# EAGLE design expansion-sn76489-kempton-sd-rev4b (EAGLE 9.6.2)
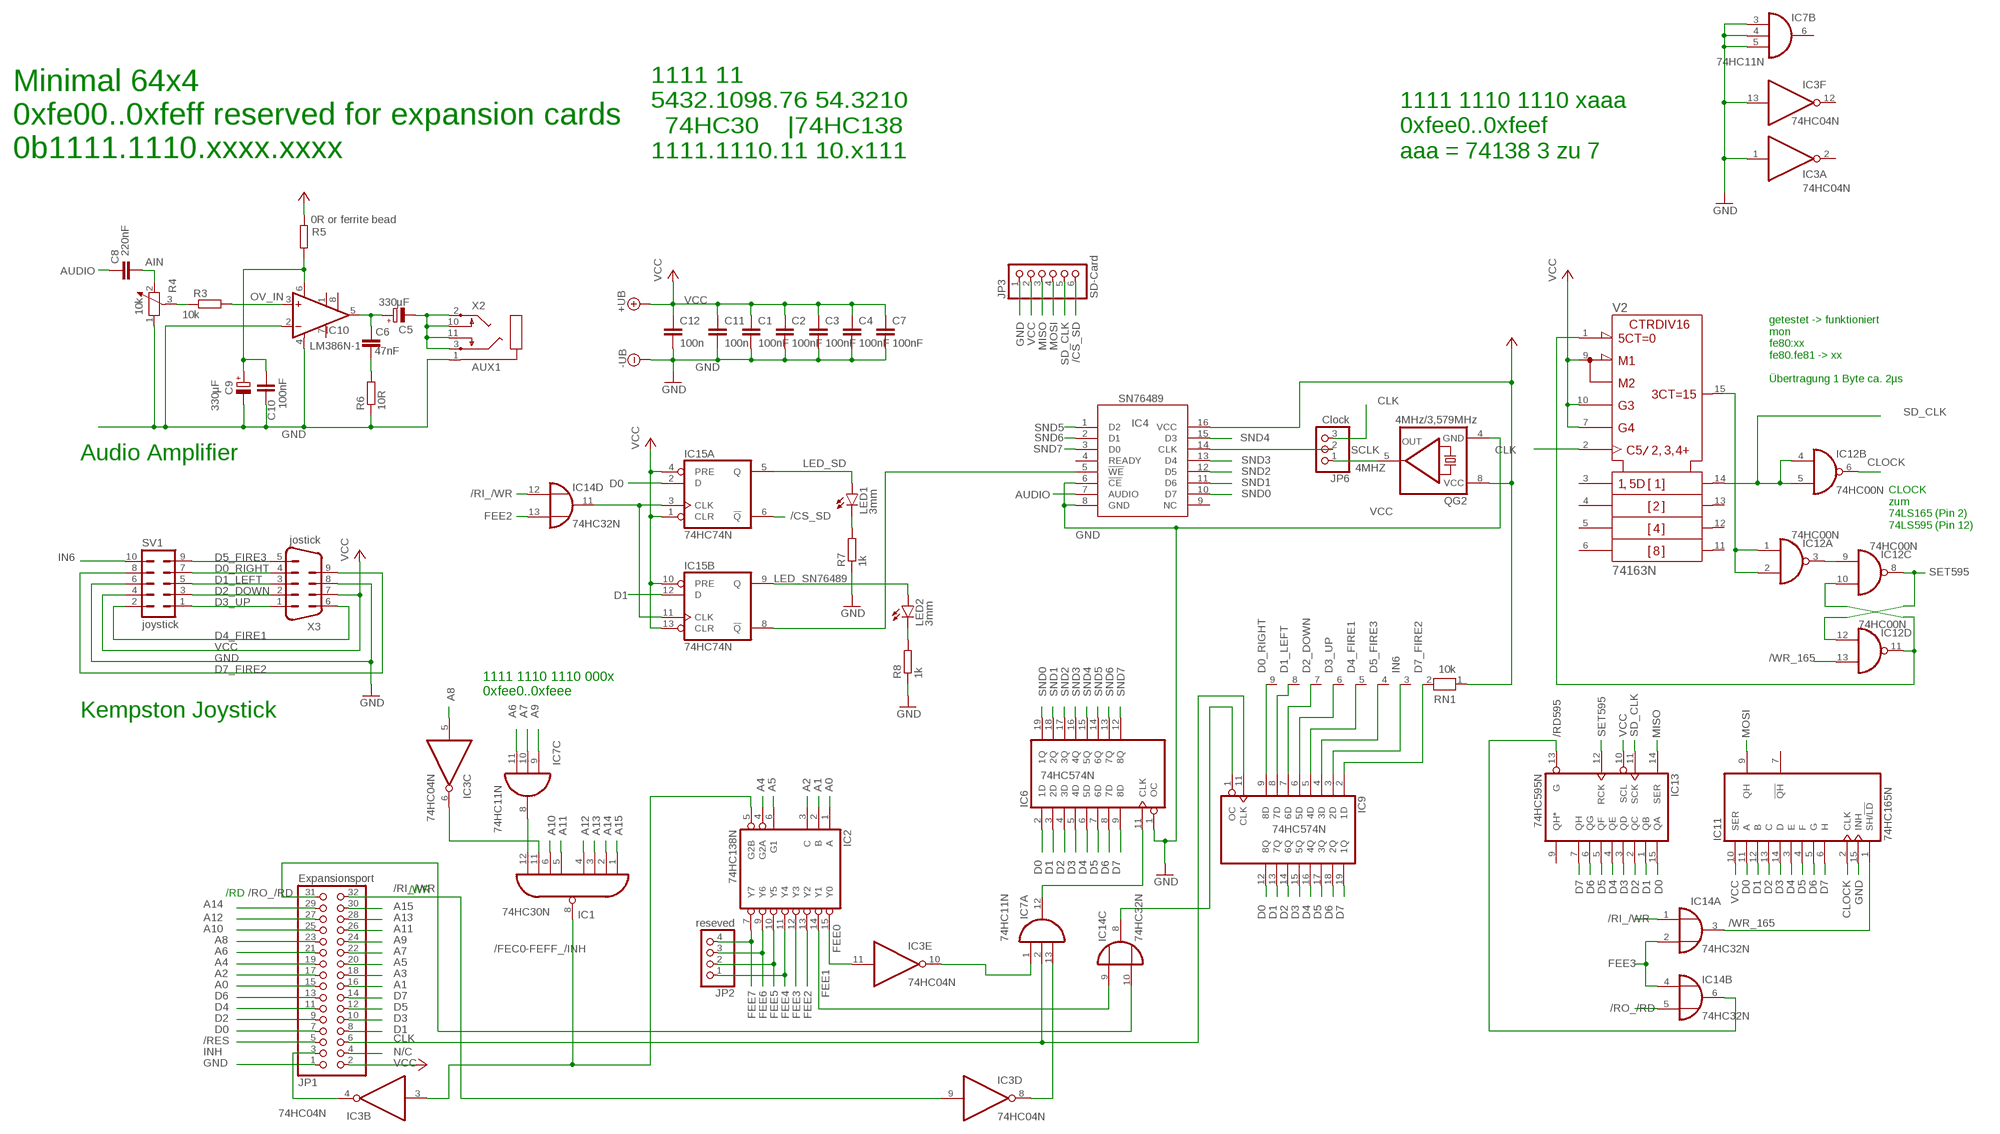
[diagram p0: schematic, sheet 1]

## Parts
C1  100nF  C-EU050-025X075  [C050-025X075]
C2  100nF  C-EU050-025X075  [C050-025X075]
C3  100nF  C-EU050-025X075  [C050-025X075]
C4  100nF  C-EU050-025X075  [C050-025X075]
C5  330µF  CPOL-EUE2.5-7  [E2,5-7]
C6  47nF  C-EU050-025X075  [C050-025X075]
C7  100nF  C-EU050-025X075  [C050-025X075]
C8  220nF  C-EU050-025X075  [C050-025X075]
C9  330µF  CPOL-EUE2.5-7  [E2,5-7]
C10  100nF  C-EU050-025X075  [C050-025X075]
C11  100n  C-EU050-025X075  [C050-025X075]
C12  100n  C-EU050-025X075  [C050-025X075]
IC1  74HC30N  [DIL14]
IC2  74HC138N  [DIL16]
IC3  74HC04N  [DIL14]
IC4  SN76489  ALEX-PARTS_SN76489AN  [ALEX-PARTS_DIL16]
IC6  74HC574N  [DIL20]
IC7  74HC11N  [DIL14]
IC9  74HC574N  [DIL20]
IC10  LM386N-1  [DIL08]
IC11  74HC165N  [DIL16]
IC12  74HC00N  [DIL14]
IC13  74HC595N  [DIL16]
IC14  74HC32N  [DIL14]
IC15  74HC74N  [DIL14]
JP1  Expansionsport  PINHD-2X16  [2X16]
JP2  reseved  PINHD-1X4  [1X04]
JP3  SD-Card  PINHD-1X6  [1X06]
JP6  Clock  PINHD-1X3  [1X03]
LED1  3mm  LED3MM  [LED3MM]
LED2  3mm  LED3MM  [LED3MM]
QG2  4MHz/3,579MHz  QG5460  [DIL08S]
R3  10k  R-EU_0207/10  [0207/10]
R4  10k  POTENTIOMETER_PT-10S  [PT-10S]
R5  0R or ferrite bead  R-EU_0207/10  [0207/10]
R6  10R  R-EU_0207/10  [0207/10]
R7  1k  R-EU_0207/10  [0207/10]
R8  1k  R-EU_0207/10  [0207/10]
RN1  10k  RN08  [RN-9]
SV1  joystick  ML10  [ML10]
V2  74163N  [DIL16]
X2  AUX1  CON-SJ1-352XNSJ1-352XN  [SJ1-352XN]
X3  jostick  M09-182  [182-009-MALE]

## Nets
4MHZ: JP6.1 QG2.5(OUT)
/CS_SD: IC15.6(A:!Q) JP3.6
/FEC0-FEFF_/INH: IC1.8(O) IC2.5(G2B) IC3.3(B:I)
/RD595: IC13.13(G) IC14.6(B:O)
/RES: JP1.5
/RI_/WR: IC3.9(D:I) IC14.1(A:I0) IC14.12(D:I0) JP1.32
/RO_/RD: IC14.5(B:I1) IC14.10(C:I1) JP1.31
/WR_165: IC11.1(SH/!LD) IC12.13(D:I1) IC14.3(A:O)
A0: IC2.1(A) JP1.15
A1: IC2.2(B) JP1.16
A2: IC2.3(C) JP1.17
A3: JP1.18
A4: IC2.4(G2A) JP1.19
A5: IC2.6(G1) JP1.20
A6: IC7.11(C:I2) JP1.21
A7: IC7.10(C:I1) JP1.22
A8: IC3.5(C:I) JP1.23
A9: IC7.9(C:I0) JP1.24
A10: IC1.6(I5) JP1.25
A11: IC1.5(I4) JP1.26
A12: IC1.4(I3) JP1.27
A13: IC1.3(I2) JP1.28
A14: IC1.2(I1) JP1.29
A15: IC1.1(I0) JP1.30
AIN: C8.2 R4.2
AUDIO: C8.1 IC4.7(AUDIO)
AUXOUT1: C5.- X2.2 X2.3 X2.10 X2.11
AVCC [power]: C9.+ C10.1 IC10.6(VS) R5.1
CLK: IC7.2(A:I1) IC9.11(CLK) JP1.6 JP6.3 V2.2(CLK)
CLOCK: IC11.2(CLK) IC12.6(B:O)
D0: IC6.2(1D) IC9.12(8Q) IC11.11(A) IC13.15(QA) IC15.2(A:D) JP1.7
D0_RIGHT: IC9.9(8D) RN1.9 SV1.7 X3.4
D1: IC6.3(2D) IC9.13(7Q) IC11.12(B) IC13.1(QB) IC15.12(B:D) JP1.8
D1_LEFT: IC9.8(7D) RN1.8 SV1.5 X3.3
D2: IC6.4(3D) IC9.14(6Q) IC11.13(C) IC13.2(QC) JP1.9
D2_DOWN: IC9.7(6D) RN1.7 SV1.3 X3.2
D3: IC6.5(4D) IC9.15(5Q) IC11.14(D) IC13.3(QD) JP1.10
D3_UP: IC9.6(5D) RN1.6 SV1.1 X3.1
D4: IC6.6(5D) IC9.16(4Q) IC11.3(E) IC13.4(QE) JP1.11
D4_FIRE1: IC9.5(4D) RN1.5 SV1.2 X3.6
D5: IC6.7(6D) IC9.17(3Q) IC11.4(F) IC13.5(QF) JP1.12
D5_FIRE3: IC9.4(3D) RN1.4 SV1.9 X3.5
D6: IC6.8(7D) IC9.18(2Q) IC11.5(G) IC13.6(QG) JP1.13
D7: IC6.9(8D) IC9.19(1Q) IC11.6(H) IC13.7(QH) JP1.14
D7_FIRE2: IC9.2(1D) RN1.2 SV1.8 X3.9
FEE0: IC2.15(Y0) IC3.11(E:I)
FEE1: IC2.14(Y1) IC14.9(C:I0)
FEE2: IC2.13(Y2) IC14.13(D:I1)
FEE3: IC2.12(Y3) IC14.2(A:I1) IC14.4(B:I0)
FEE4: IC2.11(Y4) JP2.1
FEE5: IC2.10(Y5) JP2.2
FEE6: IC2.9(Y6) JP2.3
FEE7: IC2.7(Y7) JP2.4
GND [power]: C1.2 C2.2 C3.2 C4.2 C7.2 C9.- C10.2 C11.2 C12.2 IC3.1(A:I) IC3.13(F:I) IC4.6(!CE) IC4.8(GND) IC6.1(OC) IC7.3(B:I0) IC7.4(B:I1) IC7.5(B:I2) IC10.2(-IN) IC10.4(GND) IC11.15(INH) JP1.1 JP3.1 QG2.4(GND) R4.1 R6.1 R7.1 R8.1 SV1.6 X2.1 X3.8 ; supply symbol labelled -UB
IN6: IC9.3(2D) RN1.3 SV1.10
INH: IC3.4(B:O) JP1.3
INPUT_EN: IC9.1(OC) IC14.8(C:O)
LED_SD: IC15.5(A:Q) LED1.A
LED_SN76489: IC15.9(B:Q) LED2.A
MISO: IC13.14(SER) JP3.3
MOSI: IC11.9(QH) JP3.4
N$1: LED2.K(C) R8.2
N$2: IC3.10(E:O) IC7.1(A:I0)
N$3: IC1.12(I7) IC7.8(C:O)
N$6: C6.2 R6.2
N$7: IC12.1(A:I0) IC12.2(A:I1) V2.15(RCO)
N$8: R3.1 R4.3
N$9: IC12.10(C:I1) IC12.11(D:O) V2.1(!CLR)
N$10: IC12.3(A:O) IC12.9(C:I0)
N$11: IC14.11(D:O) IC15.3(A:CLK) IC15.11(B:CLK)
N$12: LED1.K(C) R7.2
N$14: IC4.5(!WE) IC15.8(B:!Q)
N$19: IC1.11(I6) IC3.6(C:O)
N/C: JP1.4
OV_IN: IC10.3(+IN) R3.2
R2C2C3: C5.+ C6.1 IC10.5(OUT)
RI_WR: IC3.8(D:O) IC7.13(A:I2)
SCLK: IC4.14(CLK) JP6.2
SD_CLK: IC12.4(B:I0) IC12.5(B:I1) IC13.11(SCK) JP3.5 V2.14(QA)
SET595: IC12.8(C:O) IC12.12(D:I0) IC13.12(RCK)
SND0: IC4.10(D7) IC6.19(1Q)
SND1: IC4.11(D6) IC6.18(2Q)
SND2: IC4.12(D5) IC6.17(3Q)
SND3: IC4.13(D4) IC6.16(4Q)
SND4: IC4.15(D3) IC6.15(5Q)
SND5: IC4.1(D2) IC6.14(6Q)
SND6: IC4.2(D1) IC6.13(7Q)
SND7: IC4.3(D0) IC6.12(8Q)
SOUND_EN: IC6.11(CLK) IC7.12(A:O)
VCC [power]: C1.1 C2.1 C3.1 C4.1 C7.1 C11.1 C12.1 IC4.16(VCC) IC11.10(SER) IC13.10(SCL) IC15.1(A:CLR) IC15.4(A:PRE) IC15.10(B:PRE) IC15.13(B:CLR) JP1.2 JP3.2 QG2.8(VCC) R5.2 RN1.1 SV1.4 V2.7(ENP) V2.9(!LOAD) V2.10(ENT) X3.7 ; supply symbol labelled +UB
Unconnected: IC3.2(A:O) IC3.12(F:O) IC4.4(READY) IC4.9(NC) IC7.6(B:O) IC10.1(GAIN) IC10.7(BYPASS) IC10.8(GAIN) IC11.7(!QH) IC13.9(QH*) V2.3(A) V2.4(B) V2.5(C) V2.6(D) V2.11(QD) V2.12(QC) V2.13(QB)

## Notes on the sheet
- Minimal 64x4
  0xfe00..0xfeff reserved for expansion cards
  0b1111.1110.xxxx.xxxx
- 1111 11
  5432.1098.76 54.3210
    74HC30    |74HC138
  1111.1110.11 10.x111
- 1111 1110 1110 xaaa
  0xfee0..0xfeef
  aaa = 74138 3 zu 7
- getestet -> funktioniert
  mon
  fe80:xx
  fe80.fe81 -> xx
  
  Übertragung 1 Byte ca. 2µs
- Audio Amplifier
- CLOCK
  zum
  74LS165 (Pin 2)
  74LS595 (Pin 12)
- 1111 1110 1110 000x
  0xfee0..0xfeee
- Kempston Joystick
- /WR
- /RD

## Power pins joined to a net without a drawn wire
GND: IC1.7(GND) IC2.8(GND) IC3.7(P:GND) IC6.10(GND) IC7.7(P:GND) IC9.10(GND) IC11.8(GND) IC12.7(P:GND) IC13.8(GND) IC14.7(P:GND) IC15.7(P:GND) V2.8(-UB)
VCC: IC1.14(VCC) IC2.16(VCC) IC3.14(P:VCC) IC6.20(VCC) IC7.14(P:VCC) IC9.20(VCC) IC11.16(VCC) IC12.14(P:VCC) IC13.16(VCC) IC14.14(P:VCC) IC15.14(P:VCC) V2.16(+UB)

## Library data of the parts
C1-C4 C6-C8 C10-C12 = rcl:C-EU: CAPACITOR, European symbol; SPICEPREFIX: C
C5 C9 = rcl:CPOL-EU: POLARIZED CAPACITOR, European symbol; SPICEPREFIX: C
IC1 = 74xx-eu:74*30: 8-input NAND gate
IC2 = 74xx-eu:74*138: 3-line to 8-line DECODER/DEMULTIPLEXER
IC3 = 74xx-eu:74*04: Hex INVERTER
IC4 = squareinator2:ALEX-PARTS_SN76489AN: TI SN76489AN Sound Generator
IC6 IC9 = 74xx-eu:74*574: 8-bit D type FLIP FLOP bus driver
IC7 = 74xx-eu:74*11: Triple 3-input AND gate
IC10 = linear:LM386?-*: Low Voltage Audio Power Amplifier Source: http://cache.national.com/ds/LM/LM386.pdf
IC11 = 74xx-eu:74*165: 8-bit parallel load SHIFT REGISTER
IC12 = 74xx-eu:74*00: Quad 2-input NAND gate
IC13 = 74xx-eu:74*595: 8-bit SHIFT REGISTER, output latch
IC14 = 74xx-eu:74*32: Quad 2-input OR gate
IC15 = 74xx-eu:74*74: Dual D type positive edge triggered FLIP FLOP, preset and clear
JP1 = pinhead:PINHD-2X16: PIN HEADER
JP2 = pinhead:PINHD-1X4: PIN HEADER
JP3 = pinhead:PINHD-1X6: PIN HEADER
JP6 = pinhead:PINHD-1X3: PIN HEADER
LED1 LED2 = led:LED: LED OSRAM: - CHIPLED LG R971, LG N971, LY N971, LG Q971, LY Q971, LO R971, LY R971 LH N974, LH R974 LS Q976, LO Q976, LY Q976 LO Q996 - Hyper CHIPLED LW Q18S LB Q993, LB Q99A, LB R99A - SideLED LS A670, LO A670, LY A670, LG A670, LP A670 LB A673, LV A673, LT A673, LW A673 LH A674 LY A675 LS A676, LA A676, LO A676, LY A676, LW A676 LS A679, LY A679, LG A679 - Hyper Micro SIDELED® LS Y876, LA Y876, LO Y876, LY Y876 LT Y87S - SmartLED LW L88C, LW L88S LB L89C, LB L89S, LG L890 LS L89K, LO L89K, LY L89K LS L896, LA L896, LO L896, LY L896 - TOPLED LS T670, LO T670, LY T670, LG T670, LP T670 LSG T670, LSP T670, LSY T670, LOP T670, LYG T670 LG T671, LOG T671, LSG T671 LB T673, LV T673, LT T673, LW T673 LH T674 LS T676, LA T676, LO T676, LY T676, LB T676, LH T676, LSB T676, LW T676 LB T67C, LV T67C, LT T67C, LS T67K, LO T67K, LY T67K, LW E67C LS E67B, LA E67B, LO E67B, LY E67B, LB E67C, LV E67C, LT E67C LW T67C LS T679, LY T679, LG T679 LS T770, LO T770, LY T770, LG T770, LP T770 LB T773, LV T773, LT T773, LW T773 LH T774 LS E675, LA E675, LY E675, LS T675 LS T776, LA T776, LO T776, LY T776, LB T776 LHGB T686 LT T68C, LB T68C - Hyper Mini TOPLED® LB M676 - Mini TOPLED Santana® LG M470 LS M47K, LO M47K, LY M47K Source: http://www.osram.convergy.de LUXEON: - LUMILED® LXK2-PW12-R00, LXK2-PW12-S00, LXK2-PW14-U00, LXK2-PW14-V00 LXK2-PM12-R00, LXK2-PM12-S00, LXK2-PM14-U00 LXK2-PE12-Q00, LXK2-PE12-R00, LXK2-PE12-S00, LXK2-PE14-T00, LXK2-PE14-U00 LXK2-PB12-K00, LXK2-PB12-L00, LXK2-PB12-M00, LXK2-PB14-N00, LXK2-PB14-P00, LXK2-PB14-Q00 LXK2-PR12-L00, LXK2-PR12-M00, LXK2-PR14-Q00, LXK2-PR14-R00 LXK2-PD12-Q00, LXK2-PD12-R00, LXK2-PD12-S00 LXK2-PH12-R00, LXK2-PH12-S00 LXK2-PL12-P00, LXK2-PL12-Q00, LXK2-PL12-R00 Source: www.luxeon.com KINGBRIGHT: KA-3528ASYC Source: www.kingbright.com
QG2 = crystal:QG5460: CRYSTAL RESONATOR; OC_FARNELL: unknown; OC_NEWARK: unknown
R3 R5-R8 = rcl:R-EU_: RESISTOR, European symbol; SPICEPREFIX: R
R4 = rcl:POTENTIOMETER_: Potentiometer; SPICEMODEL: POT; SPICEPREFIX: X
RN1 = resistor-net:RN08: RESISTOR NETWORK; OC_FARNELL: unknown; OC_NEWARK: unknown
SV1 = con-harting-ml:ML10: HARTING; OC_FARNELL: unknown; OC_NEWARK: unknown
V2 = 74ttl-din:74*163: Synchrounus 4-bit COUNTER
X2 = con-sj1-352xn:CON-SJ1-352XN: MIC/HEADPHONE JACK KS-S stereo microphone/headphone jack SJ1-352XN (CUD Devices)
X3 = con-subd:M09: SUB-D; OC_FARNELL: unknown; OC_NEWARK: unknown

## Net classes
0 default: width 0.254 mm, clearance 0.152 mm
1 power: width 0.406 mm, clearance 0.152 mm

## Board
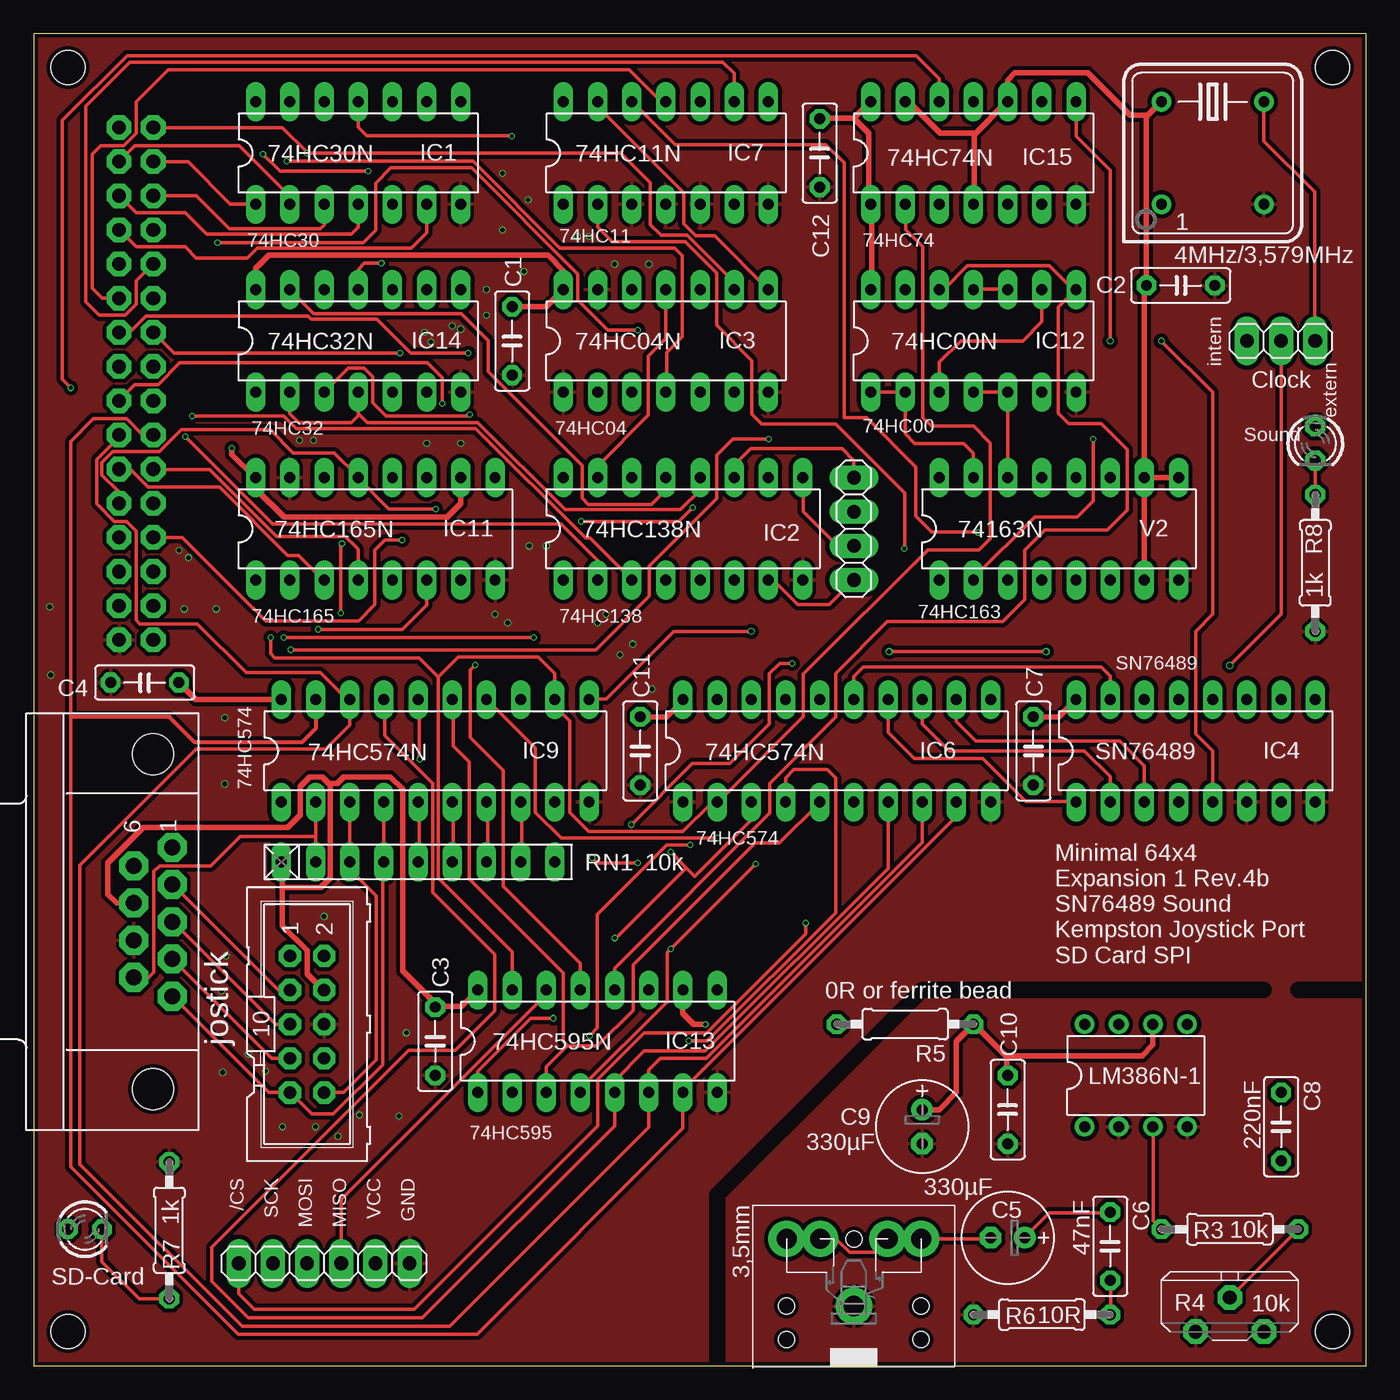
[diagram p1: board, top side]
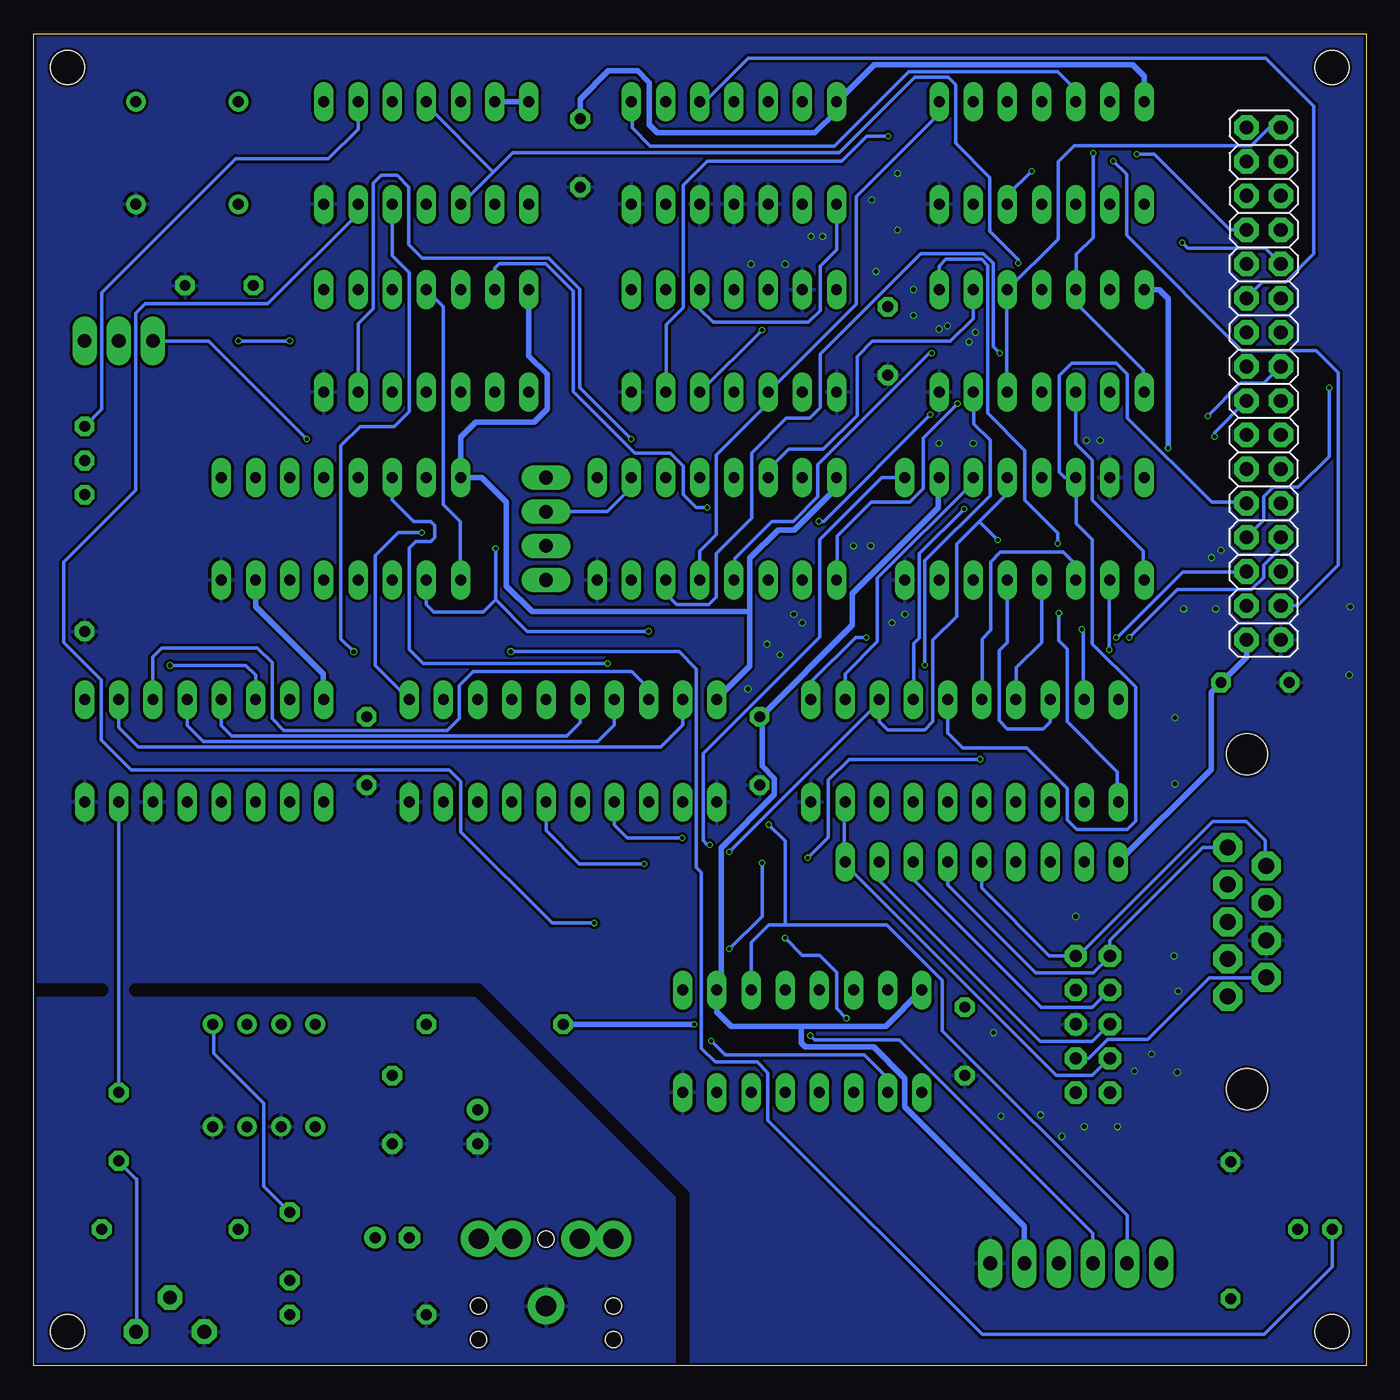
[diagram p2: board, bottom side, seen from below]

Size 99.04 x 99.05 mm. Coordinates in mm from the lower left corner, seen from the top.
Outline: 0,0 99.04,0 99.04,99.05 0,99.05 0,0
Copper layers (1*16): Top 0.035mm / dielectric 1.6mm / Bottom 0.035mm
Design rules "jlcpcb-2layers": minimum track width 5mil, minimum drill 0.3mm, track to track 5mil, track to pad 5mil, pad to pad 5mil, via to via 5mil, smd to smd 5mil, copper to edge 0.2mm, drill to drill 6mil, minimum pad ring 10mil, minimum via ring 3mil, stop-mask expansion 4mil, vias tented up to drill 0mil, thermal gap 10mil
Holes 2.54 mm at 2.54,2.54 2.54,96.52 96.52,2.54 96.52,96.52
tRestrict: 4 lines
bRestrict: 4 lines

### Footprints (pad centres in the part's own frame; a part is rotated, then mirrored left to right if it is on the bottom)
C050-025X075 = drill 0.813 octagon: 1 -2.54,0; 2 2.54,0
E2,5-7 = drill 0.813 pad 1.6: + -1.27,0 | drill 0.813 pad 1.6 octagon: - 1.27,0
DIL14 = drill 0.813 long: 1 -7.62,-3.81; 2 -5.08,-3.81; 3 -2.54,-3.81; 4 0,-3.81; 5 2.54,-3.81; 6 5.08,-3.81; 7 7.62,-3.81; 8 7.62,3.81; 9 5.08,3.81; 10 2.54,3.81; 11 0,3.81; 12 -2.54,3.81; 13 -5.08,3.81; 14 -7.62,3.81
DIL16 = drill 0.813 long: 1 -8.89,-3.81; 2 -6.35,-3.81; 3 -3.81,-3.81; 4 -1.27,-3.81; 5 1.27,-3.81; 6 3.81,-3.81; 7 6.35,-3.81; 8 8.89,-3.81; 9 8.89,3.81; 10 6.35,3.81; 11 3.81,3.81; 12 1.27,3.81; 13 -1.27,3.81; 14 -3.81,3.81; 15 -6.35,3.81; 16 -8.89,3.81
ALEX-PARTS_DIL16 = drill 0.813 long: 1 -8.89,-3.81; 2 -6.35,-3.81; 3 -3.81,-3.81; 4 -1.27,-3.81; 5 1.27,-3.81; 6 3.81,-3.81; 7 6.35,-3.81; 8 8.89,-3.81; 9 8.89,3.81; 10 6.35,3.81; 11 3.81,3.81; 12 1.27,3.81; 13 -1.27,3.81; 14 -3.81,3.81; 15 -6.35,3.81; 16 -8.89,3.81
DIL20 = drill 0.813 long: 1 -11.43,-3.81; 2 -8.89,-3.81; 3 -6.35,-3.81; 4 -3.81,-3.81; 5 -1.27,-3.81; 6 1.27,-3.81; 7 3.81,-3.81; 8 6.35,-3.81; 9 8.89,-3.81; 10 11.43,-3.81; 11 11.43,3.81; 12 8.89,3.81; 13 6.35,3.81; 14 3.81,3.81; 15 1.27,3.81; 16 -1.27,3.81; 17 -3.81,3.81; 18 -6.35,3.81; 19 -8.89,3.81; 20 -11.43,3.81
DIL08 = drill 0.813 pad 1.27: 1 -3.81,-3.81; 2 -1.27,-3.81; 3 1.27,-3.81; 4 3.81,-3.81; 5 3.81,3.81; 6 1.27,3.81; 7 -1.27,3.81; 8 -3.81,3.81
2X16 = drill 1.016 octagon: 1 -19.05,-1.27; 2 -19.05,1.27; 3 -16.51,-1.27; 4 -16.51,1.27; 5 -13.97,-1.27; 6 -13.97,1.27; 7 -11.43,-1.27; 8 -11.43,1.27; 9 -8.89,-1.27; 10 -8.89,1.27; 11 -6.35,-1.27; 12 -6.35,1.27; 13 -3.81,-1.27; 14 -3.81,1.27; 15 -1.27,-1.27; 16 -1.27,1.27; 17 1.27,-1.27; 18 1.27,1.27; 19 3.81,-1.27; 20 3.81,1.27; 21 6.35,-1.27; 22 6.35,1.27; 23 8.89,-1.27; 24 8.89,1.27; 25 11.43,-1.27; 26 11.43,1.27; 27 13.97,-1.27; 28 13.97,1.27; 29 16.51,-1.27; 30 16.51,1.27; 31 19.05,-1.27; 32 19.05,1.27
1X04 = drill 1.016 long: 1 -3.81,0; 2 -1.27,0; 3 1.27,0; 4 3.81,0
1X06 = drill 1.016 long: 1 -6.35,0; 2 -3.81,0; 3 -1.27,0; 4 1.27,0; 5 3.81,0; 6 6.35,0
1X03 = drill 1.016 long: 1 -2.54,0; 2 0,0; 3 2.54,0
LED3MM = drill 0.813 octagon: A -1.27,0; K 1.27,0
DIL08S = drill 0.813: 1 -3.81,-3.81; 4 3.81,-3.81; 5 3.81,3.81; 8 -3.81,3.81
0207/10 = drill 0.813 octagon: 1 -5.08,0; 2 5.08,0
PT-10S = drill 1.016 pad 1.778 octagon: 1 -2.54,-1.27; 2 2.54,-1.27; 3 0,1.27
RN-9 = drill 0.813 long: 1 -10.16,0; 2 -7.62,0; 3 -5.08,0; 4 -2.54,0; 5 0,0; 6 2.54,0; 7 5.08,0; 8 7.62,0; 9 10.16,0
ML10 = drill 0.914 octagon: 1 -5.08,-1.27; 2 -5.08,1.27; 3 -2.54,-1.27; 4 -2.54,1.27; 5 0,-1.27; 6 0,1.27; 7 2.54,-1.27; 8 2.54,1.27; 9 5.08,-1.27; 10 5.08,1.27
SJ1-352XN = drill 1.5 pad 2.184: 1 0,0; 2 5,-5; 3 5,5; 10 5,-2.5; 11 5,2.5 | hole 1.2: 5,0; 0,5; 0,-5; -2.5,-5; -2.5,5
182-009-MALE = drill 1.194 pad 1.524 octagon: 1 -5.537,10.923; 2 -2.769,10.923; 3 0,10.923; 4 2.769,10.923; 5 5.537,10.923; 6 -4.153,8.08; 7 -1.384,8.08; 8 1.384,8.08; 9 4.153,8.08 | hole 3.048: -12.446,9.501; 12.446,9.501

### Placement (x,y rotation side)
C1  35.56,76.2 270 top
C2  85.25,80.33 0 top
C3  29.84,24.13 270 top
C4  8.26,50.8 180 top
C5  72.39,9.53 180 top
C6  80.01,8.89 270 top
C7  74.3,45.72 270 top
C8  92.71,17.78 270 top
C9  66.04,17.78 270 top
C10  72.39,19.05 270 top
C11  45.09,45.72 270 top
C12  58.42,90.17 270 top
IC1  24.13,90.17 0 top
IC2  48.26,62.23 0 top
IC3  46.99,76.2 0 top
IC4  86.36,45.72 0 top
IC6  59.69,45.72 0 top
IC7  46.99,90.17 0 top
IC9  29.84,45.72 0 top
IC10  81.92,21.59 0 top
IC11  25.4,62.23 0 top
IC12  69.85,76.2 0 top
IC13  41.91,24.13 0 top
IC14  24.13,76.2 0 top
IC15  69.85,90.17 0 top
JP1  7.62,73.03 90 bottom
JP2  60.96,62.23 270 top
JP3  21.59,7.62 180 top
JP6  92.71,76.2 180 top
LED1  3.81,10.16 0 top
LED2  95.25,68.58 270 top
QG2  87.63,90.17 0 top
R3  88.9,10.16 180 top
R4  88.9,3.81 0 top
R5  64.77,25.4 180 top
R6  74.93,3.81 0 top
R7  10.08,10.08 270 top
R8  95.25,59.69 90 top
RN1  28.57,37.47 0 top
SV1  20.32,25.4 270 top
V2  76.2,62.23 0 top
X2  60.96,4.45 90 top
X3  -0.64,33.02 270 top

### Tracks (layer width: path | path; a pad name or v marks a point on that pad's centre or on a via)
4MHZ
  Top 0.254: QG2.5 91.44,91.06 95.2,87.3 95.2,76.2 JP6.1
/CS_SD  (via drill 0.3)
  Top 0.254: v57.38,32.91 57.38,32.11 50.01,24.74 45.37,24.74 41.91,21.29 41.91,17.84 28.29,4.22 16.4,4.22 15.24,5.38 JP3.6
  Bottom 0.254: IC15.6 74.93,85.66 81.62,78.97 90.73,78.97 91.44,78.26 91.44,65.1 96.79,59.75 96.79,53.78 94.02,51.01 94.02,46.54 91.78,44.3 68.15,44.3 67.29,43.44 67.29,39.71 60.5,32.91 v57.38,32.91
/FEC0-FEFF_/INH
  Bottom 0.254: IC2.5 49.53,60.59 48.3,61.82 48.3,67.7 44.5,71.51 44.5,72.34 IC3.3 37.91,78.93 37.91,86.91 31.8,93.02 31.8,93.98 IC1.8
/RD595  (via drill 0.3)
  Top 0.254: v32.82,52.11 32.45,51.75 32.45,46.72 34.91,44.26 34.91,35.64 40.64,29.91 IC13.13
  Bottom 0.254: v32.82,52.11 32.82,59.85 27.95,64.72 27.95,68.83 29.16,70.03 29.16,72.34 IC14.6
/RI_/WR  (via drill 0.3)
  Top 0.254: IC3.9 52.02,80.06 52.02,80.6 48.57,84.06 46.63,84.06 45.83,84.86 45.83,87.95 43.62,90.17 20.36,90.17 | v20.29,90.15 20.29,90.17 20.36,90.17 | JP1.32 8.94,92.05 18.49,92.05 20.32,90.22 20.36,90.17
  Bottom 0.254: IC14.1 16.56,72.44 16.56,74.03 21.59,79.06 IC14.12 21.54,80.06 21.54,82.64 20.29,83.89 v20.29,90.15
/RO_/RD
  Bottom 0.254: IC14.5 26.72,72.44 26.72,79.96 IC14.10 22.9,83.78 22.9,89.54 21.72,90.73 8.53,90.73 7.21,92.05 6.4,92.05 JP1.31
/WR_165  (via drill 0.3)
  Top 0.254: v48.97,63.8 47.95,62.79 v40.7,62.79 | v32.41,70.71 32.31,70.71 32.21,70.61 26.21,70.61 25.2,71.63 25.2,73.56 24.59,74.17 23.37,74.17 IC14.3
  Bottom 0.254: IC14.3 21.59,68.58 20.36,67.35 20.36,64.38 16.56,60.57 16.56,58.42 IC11.1 | IC12.13 64.77,81.6 64.42,81.95 60.98,81.95 58.93,79.9 58.93,72.44 54.36,67.87 51.71,67.87 50.76,66.91 50.76,64.76 49.8,63.8 v48.97,63.8 | v40.7,62.79 40.34,62.79 v32.41,70.71
A0  (via drill 0.3)
  Top 0.254: v30.38,71.53 30.38,73.46 29.26,74.57 10.87,74.57 9.25,72.95 7.52,72.95 6.4,71.83 JP1.15
  Bottom 0.254: v30.38,71.53 32.92,68.99 32.92,65.23 33.93,64.21 36.8,64.21 39.32,61.69 39.32,58.42 IC2.1
A1  (via drill 0.3)
  Top 0.254: IC2.2 41.91,59.89 39.21,62.59 17.78,62.59 v11.28,69.09
  Bottom 0.254: v11.28,69.09 11.28,69.39 8.94,71.73 JP1.16
A2  (via drill 0.3)
  Top 0.254: IC2.3 44.45,58.46 41.37,61.54 41.03,61.54 32.87,69.7 19.51,69.7 18.59,70.61 v11.79,70.61
  Bottom 0.254: v11.79,70.61 9.35,73.05 7.62,73.05 6.4,74.27 JP1.17
A4  (via drill 0.3)
  Top 0.254: v32.31,75.29 28.04,75.29 25.5,77.83 20.62,77.83 20.42,78.03 8.33,78.03 7.21,76.91 6.4,76.91 JP1.19
  Bottom 0.254: v32.31,75.29 32.47,75.29 40.75,67 40.75,64.61 42.59,62.78 44.2,62.78 46.94,60.04 46.94,58.42 IC2.4
A5  (via drill 0.3)
  Top 0.254: v27.23,75.29 10.46,75.29 8.94,76.81 JP1.20
  Bottom 0.254: IC2.6 52.07,57.43 51.23,56.59 48.86,56.59 48.3,57.15 48.3,60.41 45.68,63.03 45.68,67.87 43.09,70.45 41.37,70.45 40.6,71.23 40.6,75.23 33.12,82.7 28.45,82.7 27.74,81.99 27.74,75.79 v27.23,75.29
A6
  Top 0.254: IC7.11 46.63,93.98 44.25,96.36 10,96.36 7.62,93.99 7.62,91.64 6.71,90.73 5,90.73 4.37,90.1 4.37,80.11 5.11,79.38 JP1.21
A7
  Bottom 0.254: IC7.10 49.17,93.98 45.92,97.23 7.45,97.23 3.89,93.67 3.89,82.67 5.99,80.57 7.72,80.57 8.84,79.45 JP1.22
A8  (via drill 0.3)
  Top 0.254: v44.91,77.01 42.67,77.01 40.44,79.25 40.44,81.18 32.55,89.06 26.55,89.06 25.43,87.94 25.43,84.45 24.5,83.52 v13.66,83.52
  Bottom 0.254: v44.91,77.01 IC3.5 | v13.66,83.52 13.26,83.11 7.52,83.11 6.4,81.99 JP1.23
A9
  Top 0.254: IC7.9 52.07,96.08 51.23,96.93 7.15,96.93 3.88,93.66 3.88,79.11 4.86,78.13 6.81,78.13 7.62,78.94 7.62,80.67 8.84,81.89 JP1.24
A10
  Top 0.254: IC1.6 29.21,84.25 28.06,83.11 16.61,83.11 15.88,82.37 12.09,82.37 11.25,83.21 7.62,83.21 6.4,84.43 JP1.25
A11  (via drill 0.3)
  Top 0.254: v17.04,90.09 18.31,88.82 v24.87,88.82
  Bottom 0.254: IC1.5 26.67,87.02 v24.87,88.82 | v17.04,90.09 15.77,90.09 10.13,84.45 JP1.26
A12
  Top 0.254: IC1.4 24.13,84.65 23.6,84.12 12.88,84.12 11.25,85.75 7.62,85.75 6.4,86.97 JP1.27
A13
  Top 0.254: IC1.3 21.59,84.81 21.31,84.53 14.55,84.53 12.09,87 JP1.28
A14
  Top 0.254: IC1.2 19.05,86.96 15.28,90.73 7.52,90.73 6.4,89.61 JP1.29
A15
  Top 0.254: IC1.1 14.63,86.36 11.48,89.51 11.43,89.53 JP1.30
AIN
  Bottom 0.254: R4.2 91.39,2.59 91.39,13.89 91.44,13.89 92.71,15.16 C8.2
AUDIO
  Bottom 0.254: C8.1 IC4.7
AUXOUT1
  Top 0.254: X2.3 55.98,9.45 58.42,9.45 X2.11 58.52,9.35 59.74,9.35 60.66,8.43 62.48,8.43 63.4,9.35 X2.10 63.5,9.45 65.84,9.45 X2.2 66.04,9.45 71.12,9.45 C5.-
AVCC
  Top 0.406: 72.34,22.96 72.34,21.64 C10.1 | 72.34,22.96 69.9,25.4 R5.1 68.58,24.13 68.58,20.32 67.31,19.05 C9.+ | IC10.6 83.19,23.85 82.4,23.06 72.44,23.06 72.34,22.96
CLK  (via drill 0.3, 0.35)
  Top 0.254: v64.71,60.76 64.75,60.73 64.75,64.9 59.62,70.02 54.11,70.02 53.38,70.75 53.38,74.74 50.77,77.36 50.77,81.25 48.44,83.57 42.99,83.57 41.91,84.65 IC7.2 | IC9.11 41.35,49.58 42.55,49.58 47.57,54.6 53.33,54.6 v53.34,54.61 | v78.75,68.92 78.75,64.29 77.57,63.11 74.38,63.11 69.85,58.57 V2.2 | v18.59,54.15 37.15,54.15 v37.16,54.14
  Bottom 0.254: JP6.3 86.04,76.2 v78.75,68.92 | V2.2 69.85,56.59 69.29,56.04 65.64,56.04 64.71,56.97 | 64.71,56.97 v64.71,60.76 | 64.71,56.97 62.35,54.61 v53.34,54.61 | v18.59,54.15 18.51,54.15 13.64,59.03 8.94,59.03 JP1.6 | v37.16,54.14 37.96,54.14 41.27,50.83 IC9.11
CLOCK  (via drill 0.3)
  Top 0.254: v19.1,53.24 41.77,53.24 45.76,57.23 45.76,59.48 50.77,64.48 50.77,67.71 51.96,68.9 v54.63,68.9
  Bottom 0.254: v19.1,53.24 19.1,58.42 IC11.2 | v54.63,68.9 58.46,72.74 58.46,80.07 60.75,82.36 70.17,82.36 71.16,83.35 71.16,87.64 72.03,88.51 73.22,88.51 73.78,87.94 73.78,78.62 74.93,77.47 IC12.6
D0  (via drill 0.3)
  Top 0.254: IC13.15 35.56,30.79 30.07,36.27 30.07,51.21 | IC15.2 64.82,86.36 64.82,84.46 66.08,83.2 66.08,70.51 66.74,69.85 69.87,69.85 71.11,68.61 71.11,61.5 70.26,60.65 66.43,60.65 57.21,51.42 57.21,48.27 50.9,41.96 IC6.2 50.8,41.86 50.39,41.86 48.26,39.73 41.25,39.73 39.83,41.15 39.83,47.95 38.81,48.97 38.81,49.48 IC9.12 38.73,51.46 37.49,52.7 31.57,52.7 30.07,51.21 | v17.62,54.15 17.62,52.95 17.94,52.63 28.65,52.63 30.07,51.21
  Bottom 0.254: IC11.11 29.26,66.04 29.26,65.63 36.34,58.56 36.34,53.84 38.73,51.44 IC9.12 | v17.62,54.15 14.06,57.71 8.53,57.71 7.62,58.62 7.62,59.54 6.4,60.76 6.4,61.57 JP1.7
D0_RIGHT
  Top 0.254: SV1.7 17.68,22.86 10.36,30.18 X3.4
  Bottom 0.254: IC9.9 38.81,41.86 38.81,37.49 RN1.9 38.73,37.27 23.05,21.58 20.38,21.58 19.1,22.86 SV1.7
D1  (via drill 0.3)
  Top 0.254: v38.63,25.85 36.96,25.85 33.02,21.91 IC13.1 | v43.2,31.8 43.28,31.8 48.51,37.03 | IC6.3 53.34,40.59 49.15,36.4 48.51,37.03 | 48.51,37.03 v47.35,38.2 | v27.38,61.39 26.11,61.39 25.36,60.64 25.36,56.59 24.16,55.39 17.27,55.39 16.31,56.35 16.28,56.35 11.06,61.57 8.94,61.57 JP1.8 | IC15.12 67.31,95.69 65.58,97.42 6.95,97.42 2.12,92.59 2.12,73.35 v2.76,72.71
  Bottom 0.254: 28.76,62.78 26.72,64.82 26.72,66.04 IC11.12 | 28.76,62.78 30.44,61.11 30.44,55.72 32.21,53.95 32.21,47.9 32.83,47.28 35.57,47.28 36.2,47.9 IC9.13 36.17,49.38 v47.35,38.2 | v43.2,31.8 41.93,30.53 40.62,30.53 39.34,29.25 39.34,26.57 v38.63,25.85 | v27.38,61.39 28.76,62.78 | v2.76,72.71 2.76,67.61 5.04,65.33 6.91,65.33 7.62,64.62 7.62,62.89 8.84,61.67 JP1.8
D1_LEFT
  Top 0.254: RN1.8 36.27,37.49 36.27,41.86 IC9.8 | SV1.5 17.98,25.4 10.36,33.02 X3.3
  Bottom 0.254: RN1.8 36.2,36.07 24.24,24.12 20.38,24.12 19.1,25.4 SV1.5
D2  (via drill 0.3)
  Top 0.254: v48.68,24.16 50.06,24.16 59.59,33.69 59.59,43.71 58.98,44.32 56.5,44.32 55.88,43.71 IC6.4 | v29.89,63.71 26.41,63.71 24.18,65.94 IC11.13 24.08,66.14 22.35,67.87 19.3,67.87 17.57,69.6 10.97,69.6 9.35,67.97 5.89,67.97 5.08,67.16 5.08,66.24 6.3,65.02 6.3,64.21 JP1.9 | v50.85,39.24 39.2,39.24 37.29,41.15 37.29,45.92 33.73,49.48 IC9.14
  Bottom 0.254: IC13.2 35.56,21.36 37.31,23.12 47.64,23.12 v48.68,24.16 | v29.89,63.71 33.22,60.38 33.22,54.13 33.63,53.72 33.63,49.58 IC9.14 | IC6.4 55.88,40.2 54.91,39.24 v50.85,39.24
D2_DOWN
  Top 0.254: RN1.7 33.73,37.49 33.73,41.86 IC9.7 | SV1.3 18.19,27.94 10.36,35.76 X3.2
  Bottom 0.254: RN1.7 33.66,36.15 24.16,26.66 20.38,26.66 19.1,27.94 SV1.3
D3
  Top 0.254: IC13.3 38.1,22.21 39.68,23.79 | 39.68,23.79 39.69,23.81 39.38,24.12 39.38,29.22 32.38,36.22 32.38,44.9 31.19,46.08 31.19,49.48 IC9.15 | IC6.5 58.42,41.86 55.42,38.86 53.61,38.86 44.55,29.79 44.55,26.43 41.9,23.79 39.68,23.79
  Bottom 0.254: IC9.15 31.11,47.04 30,45.93 25.22,45.93 22.21,42.92 22.21,40.59 21.52,39.89 17.75,39.89 17.14,40.5 17.14,50.46 20.36,53.68 20.36,61.43 21.54,62.62 21.54,65.94 IC11.14 22.41,66.04 22.82,66.44 22.82,73.64 21.89,74.56 18.59,74.56 17.75,73.72 17.75,70.47 11.48,64.21 8.94,64.21 JP1.10
D3_UP
  Top 0.254: RN1.6 31.19,37.49 31.19,41.86 IC9.6
  Bottom 0.254: X3.1 12.14,38.56 19.05,31.64 SV1.1 19.1,30.38 20.28,29.2 24.56,29.2 31.11,35.76 RN1.6
D4  (via drill 0.3)
  Top 0.254: IC13.4 40.64,20.62 47.09,27.07 47.09,30.75 47.33,30.99 v47.35,30.99 47.35,31.01 v53.67,37.33 | v28.69,45.1 28.65,45.14 28.65,49.48 IC9.16 | v44.91,37.39 v44.9,37.38 41.91,37.38 v41.51,37.78 | JP1.11 6.4,66.65 7.21,66.65 8.53,65.33 13.82,65.33 18.9,60.25 19.71,60.25 21.54,58.42 IC11.3
  Bottom 0.254: IC11.3 21.59,59.56 22.52,60.49 27.18,60.49 27.9,59.78 27.9,54.69 28.55,54.04 28.55,49.58 IC9.16 | v53.67,37.33 58.5,37.33 60.96,39.8 IC6.6 | v28.69,45.1 38.44,45.1 39.99,43.55 39.99,39.3 v41.51,37.78 | v44.91,37.39 44.91,33.43 v47.35,30.99
D4_FIRE1
  Top 0.254: RN1.5 28.65,37.49 28.65,41.86 IC9.5
  Bottom 0.254: RN1.5 28.57,35.56 28.55,35.48 23.55,30.48 SV1.2 21.4,30.48 11.4,40.48 8.94,40.48 7.52,39.06 7.52,37.19 X3.6
D5
  Top 0.254: IC6.7 63.5,36.98 49.93,23.41 45.38,23.41 43.18,21.21 IC13.5 43.18,17.86 28.89,3.57 15.93,3.57 13.23,6.28 13.23,8.8 27.87,23.45 31.32,23.45 34.27,26.4 34.27,30.59 29.67,35.2 29.67,43.32 26.11,46.87 26.11,49.48 IC9.17 | JP1.12 8.94,66.65 13.11,66.65 18.09,61.67 23.16,61.67 24,60.83 24.13,60.71 IC11.4
  Bottom 0.254: IC11.4 24.13,53.79 26.01,51.91 26.01,49.58 IC9.17
D5_FIRE3
  Top 0.254: IC9.4 RN1.4 25.93,37.36 25.93,22.37 22.29,18.73 20.67,18.73 19.08,20.32 SV1.9 17.48,20.32 10.36,27.43 X3.5
D6
  Top 0.254: IC6.8 66.04,38.91 49.97,22.84 46.56,22.84 45.72,22 IC13.6 45.72,17.72 30.92,2.93 15.49,2.93 3.42,15 3.42,37.2 12.07,45.86 21.71,45.86 23.5,47.64 IC9.18 23.27,49.58 21.3,51.55 15.79,51.55 12.17,55.17 7.9,55.17 7.62,55.45 7.62,62.08 6.91,62.79 5.99,62.79 4.67,64.11 4.67,67.36 6.3,68.99 6.3,69.19 JP1.13
  Bottom 0.254: IC9.18 23.5,47.88 24.02,47.35 26.68,47.35 27.29,47.97 27.29,53.17 26.67,53.79 IC11.5
D7  (via drill 0.3)
  Top 0.254: v21.15,54.76 27.41,54.76 29.21,56.57 IC11.6 | IC6.9 68.58,40.84 48.26,20.52 IC13.7 48.26,17.64 32.98,2.36 15.21,2.36 2.75,14.82 2.75,43.66 2.76,43.65 2.76,48.26 2.76,68.73 4.44,70.41 6.91,70.41 8.03,69.29 8.84,69.29 JP1.14
  Top 0.305: IC9.19 20.95,47.39 19.92,46.35 11.99,46.35 10.08,48.26 2.76,48.26
  Bottom 0.254: v21.15,54.76 21.03,54.64 21.03,49.58 IC9.19
D7_FIRE2
  Top 0.254: IC9.2 20.95,39.38 | RN1.2 20.95,39.38 | 20.95,39.38 15.36,39.38 13.17,37.19 9.36,37.19 8.92,36.75 8.92,29.25 8.54,28.87 X3.9
  Bottom 0.254: SV1.8 20.62,22.86 19.2,24.28 16.24,24.28 11.66,28.85 7.52,28.85 X3.9
FEE0
  Top 0.254: IC3.11 46.99,76.36 45.69,75.05 45.69,70.67 41.96,66.95 41.96,66.04 IC2.15
FEE1
  Bottom 0.254: IC2.14 44.45,66.64 42.94,68.15 40.34,68.15 37.85,70.65 37.85,75.04 36.72,76.17 30.91,76.17 29.21,77.87 IC14.9
FEE2
  Top 0.254: IC2.13 46.99,65.13 45.92,64.05 41.24,64.05 40.75,64.53 40.75,66.94 33.77,73.93 33.77,76.22 31.76,78.23 20.83,78.23 IC14.13
FEE3
  Top 0.254: IC14.2 19.05,70.8 19.72,70.14 23.62,70.14 24.13,70.64 IC14.4 24.13,70.8 24.8,70.14 33.01,70.14 39.5,63.65 48.05,63.65 49.53,65.13 IC2.12
FEE4
  Top 0.254: IC2.11 52.07,66.95 53.3,68.19 60.08,68.19 60.96,67.31 JP2.1
FEE5
  Bottom 0.254: IC2.10 54.61,65.28 56.39,63.5 JP2.2
FEE6
  Top 0.254: JP2.3 59.75,60.96 57.2,63.51 57.2,66.04 IC2.9
FEE7
  Top 0.254: IC2.7 54.97,58.42 56.79,56.59 59.13,56.59 JP2.4
GND  (via drill 0.35)
  other vias: 20.8,68.82 19.76,68.82 29.21,68.58 31.75,68.58 34.29,55.88 35.24,55.24 36.83,60.96 38.1,60.96 27.7,24.77 17.22,21.91 14.05,21.83 18.49,17.78 20.95,17.78 21.59,33.42 15.95,23.18 13.97,27.86 14.29,30.48 14.21,43.26 14.21,48.18 1.27,51.36 1.19,56.44 22.62,17.07 24.21,18.65 27.15,18.57 29.05,76.83 29.53,76.12 31.11,77.31 31.75,77.07 33.66,80.01 33.66,78.11 34.85,84.45 36.43,81.36 43.18,81.92 45.72,81.92 40.4,83.98 41.27,83.98 41.91,55.24 42.55,55.88 44.53,53.66 43.58,52.86 45.96,50.32 34.85,88.66 36.75,86.68 11.19,56.28 13.57,56.28 11.51,60.09 10.79,60.64
  pour Bottom (isolate 0.203): 0,99.06 0,0 99.06,0 99.06,99.06
  pour Top (isolate 0.305): 0,99.06 0,0 100.33,0 100.33,99.06
IN6
  Top 0.254: IC9.3 RN1.3 23.5,36.91 25.46,34.94 25.46,22.74 23.04,20.32 SV1.10
INH  (via drill 0.3)
  Top 0.254: v18.81,89.57 32.66,89.57 39.12,83.11 47.63,83.11 48.22,82.53 48.22,76.52 47.04,75.35 47.04,72.44 IC3.4
  Bottom 0.254: v18.81,89.57 17.82,88.58 17.82,84.06 9.25,75.49 3.73,75.49 2.09,73.85 2.09,59.53 5.11,56.52 JP1.3
INPUT_EN  (via drill 0.3)
  Top 0.254: v22.92,61.14 22.84,61.06 v22.84,55.98
  Bottom 0.254: v22.84,55.98 22.84,53.91 22.21,53.29 22.21,47.9 18.49,44.17 18.49,41.96 IC9.1 | v22.92,61.14 22.92,61.93 25.36,64.38 25.36,68.06 28.14,70.83 28.14,81.81 28.59,82.26 31.24,82.26 31.75,81.76 IC14.8
LED_SD  (via drill 0.35)
  Top 0.254: v75.25,53.1 v63.58,53.1
  Bottom 0.254: LED1.A 2.54,7.37 7.57,2.34 28.54,2.34 44.47,18.26 44.47,21.78 45.28,22.59 48.4,22.59 49.42,23.61 49.42,36.68 49.78,37.04 49.78,51.81 51.08,53.1 v63.58,53.1 | IC15.5 72.39,82.55 71.12,81.28 71.12,70.96 72.23,69.85 74.77,69.85 76.2,68.42 76.2,54.05 v75.25,53.1
LED_SN76489
  Bottom 0.254: IC15.9 74.93,91.95 77.13,89.76 84.01,89.76 93.98,79.79 93.98,71.12 LED2.A
MISO
  Top 0.254: IC13.14 38.1,27.64 22.86,12.39 JP3.3
MOSI  (via drill 0.3)
  Top 0.254: v48.8,38.73 47.06,38.73 41.89,33.56 41.89,25.13 v41.31,24.55
  Bottom 0.254: IC11.9 36,66.04 40.6,61.43 40.6,54.19 49.28,45.52 49.28,39.05 48.96,38.73 v48.8,38.73 | v41.31,24.55 41,24.23 34.7,24.23 20.32,9.86 JP3.4
N$1
  Top 0.254: R8.2 LED2.K
N$2
  Bottom 0.254: IC3.10 49.53,78.58 48.55,77.6 41.45,77.6 40.6,78.45 40.6,81.77 39.37,83 IC7.1
N$3
  Bottom 0.254: IC1.12 21.59,94.89 22.91,96.22 34,96.22 39.52,90.69 53.21,90.69 54.56,92.04 54.56,93.98 IC7.8
N$6
  Top 0.254: R6.2 80.06,3.86 80.06,6.3 C6.2
N$7
  Top 0.254: V2.15 69.85,67.87 69.14,68.58 65.48,68.58 64.77,69.29 IC12.2 IC12.1
N$8
  Top 0.254: R4.3 R3.1
N$9
  Top 0.254: IC12.10 72.34,80.06 69.9,80.06 IC12.11
  Bottom 0.254: V2.1 67.32,62.77 68.58,64.04 68.58,78.74 IC12.11
N$10
  Top 0.254: IC12.3 67.31,74.61 68.9,76.2 73.5,76.2 74.93,77.63 IC12.9
N$11  (via drill 0.3)
  Top 0.254: IC14.11 24.13,81.52 24.58,81.97 v25.85,81.97
  Bottom 0.254: v25.85,81.97 25.85,82.25 27.98,84.38 27.98,88.35 30.52,90.89 30.52,95.26 31.08,95.81 33.56,95.81 39.16,90.2 63.41,90.2 64.92,88.7 | 64.92,88.7 67.26,86.36 IC15.3 | IC15.11 69.8,93.98 69.8,93.67 64.92,88.8 64.92,88.7
N$12
  Top 0.254: LED1.K 5.08,7.75 7.83,5 R7.2
N$14  (via drill 0.35)
  Top 0.254: IC15.8 77.47,91.44 80.01,88.9 v80.01,76.2 | v83.82,76.2 87.63,72.39 87.63,55.88 86.36,54.61 86.36,46.99 87.63,45.72 IC4.5
  Bottom 0.254: v80.01,76.2 v83.82,76.2
N$19  (via drill 0.3)
  Top 0.254: v35.54,91.42 35.52,91.44 24.76,91.44 24.13,92.08 IC1.11
  Bottom 0.254: v35.54,91.42 37.12,91.42 38.99,89.56 48.99,89.56 50.76,87.8 50.76,78.69 52.02,77.43 52.02,72.44 IC3.6
OV_IN
  Top 0.254: R3.2 83.21,10.77 83.21,17.78 IC10.3
R2C2C3
  Top 0.254: C6.1 79.96,11.38 75.49,11.38 73.66,9.55 C5.+
  Bottom 0.254: C6.1 81.92,13.35 81.92,19.53 85.65,23.25 85.65,25.4 IC10.5
RI_WR
  Top 0.254: IC3.8 50.61,84.01 49.22,84.01 48.3,84.92 48.3,87.23 41.96,93.57 41.96,93.98 IC7.13
SCLK  (via drill 0.35)
  Top 0.254: JP6.2 92.71,55.88 v88.9,52.07
  Bottom 0.254: IC4.14 82.55,51.36 83.26,52.07 v88.9,52.07
SD_CLK  (via drill 0.3)
  Top 0.254: v56.39,52.22 55.44,52.22 54.67,51.46 54.67,47.73 51.75,44.8 48.97,44.8 v44.4,40.23 | IC12.4 IC12.5 V2.14
  Bottom 0.254: IC13.11 45.72,31.46 44.4,32.78 43.18,32.78 | 43.18,32.78 35.63,32.78 31.5,28.65 31.5,24.89 17.78,11.18 JP3.5 | V2.14 72.39,64.37 70.8,62.79 69.53,62.79 69.22,62.47 69.22,61.59 69.53,61.28 70.64,61.28 71.12,60.8 71.12,53.26 70.08,52.22 v56.39,52.22 | v44.4,40.23 43.18,39.01 43.18,32.78
SET595
  Top 0.254: IC13.12 43.18,29.57 54.7,41.09 54.7,43.31 59.63,48.23 59.63,51.49 63.46,55.32 72.01,55.32 73.66,56.97 73.66,60.65 75.16,62.15 79.79,62.15 81.27,63.63 81.27,68.13 79.35,70.06 76.93,70.06 76.17,70.83 76.17,78.7 IC12.8 77.32,79.96 75.49,81.79 69.39,81.79 67.67,80.06 67.36,80.06 IC12.12
SND0
  Bottom 0.254: IC6.19 50.8,47.66 52.44,46.02 91.27,46.02 92.71,47.47 IC4.10
SND1
  Bottom 0.254: IC6.18 53.34,50.37 54.6,51.63 66.37,51.63 67.41,50.59 67.41,48.12 68.28,47.24 80.44,47.24 81.32,48.13 81.32,52.29 82.41,53.37 89.5,53.37 90.17,52.7 IC4.11
SND2
  Bottom 0.254: IC6.17 55.88,47.66 57.11,46.43 86.44,46.43 87.63,47.62 IC4.12
SND3
  Bottom 0.254: IC6.16 58.42,47.82 59.4,46.84 84.3,46.84 85.09,47.62 IC4.13
SND4
  Top 0.254: IC6.15 60.96,51.24 61.66,51.94 79.34,51.94 80.01,51.28 IC4.15
SND5
  Top 0.254: IC4.1 77.42,41.96 73.73,41.96 70.53,45.16 65.44,45.16 63.5,47.1 IC6.14
SND6
  Top 0.254: IC4.2 80.01,43.81 78.1,45.73 68.05,45.73 66.04,47.73 IC6.13
SND7
  Top 0.254: IC4.3 82.55,44.61 80.71,46.45 70.02,46.45 68.58,47.89 IC6.12
SOUND_EN  (via drill 0.3)
  Top 0.254: IC7.12 44.5,93.98 47.68,90.8 58.86,90.8 60.23,89.44 60.23,70.48 61.91,70.48 65.56,66.83 65.56,63.18 66.75,61.99 70.16,61.99 v70.19,61.97
  Bottom 0.254: IC6.11 73.66,52.07 73.66,60.24 71.93,61.97 v70.19,61.97
VCC  (via drill 0.3)
  Top 0.406: C7.1 76.2,48.26 IC4.16 | IC12.14 62.28,80.06 62.28,86.36 IC15.1 62.08,86.46 62.08,91.64 60.96,92.76 | 82.7,92.86 82.7,80.37 | QG2.8 82.7,92.86 | 82.7,80.37 C2.1 | 60.96,92.76 58.42,92.76 C12.1 | 60.96,92.76 62.18,93.98 IC15.14 | 69.9,91.54 69.9,86.36 IC15.4 | 69.9,91.54 72.34,93.98 IC15.10 72.39,95.6 72.92,96.13 78.32,96.13 81.49,92.96 82.6,92.96 82.7,92.86 | IC15.13 65.02,93.98 67.36,91.64 69.8,91.64 69.9,91.54 | C1.1 38.1,78.74 IC3.14 39.37,81.44 38.23,82.58 17.49,82.58 16.51,81.6 IC14.14 | IC11.10 31.75,64.11 30.75,63.1 18.61,63.1 16.56,65.16 16.56,66.04 IC11.16 16.36,66.14 14.73,67.77 v14.73,68.24 | C11.1 47.04,48.26 48.26,49.48 IC6.20 | 18.49,35.56 18.49,32.72 20.32,30.89 20.32,29.16 21.54,27.94 SV1.4 | 18.49,35.56 18.49,37.39 RN1.1 | X3.7 6.18,34.4 5.52,35.07 5.52,37.4 8.15,40.03 18.9,40.03 19.81,40.95 19.81,43.08 20.52,43.79 21.44,43.79 22.05,43.18 | 22.05,43.18 22.05,36.27 21.34,35.56 18.49,35.56 | IC13.16 31.8,26.72 29.87,26.72 C3.1 29.87,26.92 27.43,29.36 27.43,42.88 26.52,43.79 23.06,43.79 22.55,43.28 22.15,43.28 22.05,43.18 | IC13.10 48.26,26.19 49.06,25.4 v49.93,25.4 | V2.7 V2.10 | V2.10 82.55,80.21 82.7,80.37 | V2.10 V2.9 | C4.1 12.06,49.53 IC9.20
  Bottom 0.406: V2.7 82.55,56.45 77.52,51.42 77.52,49.58 IC4.16 | IC1.14 16.51,95.87 17.36,96.72 36.58,96.72 39.32,93.98 IC7.14 39.37,93.28 40.98,91.67 52.69,91.67 53.28,92.27 53.28,95.42 54.15,96.28 56.33,96.28 58.42,94.19 C12.1 | IC15.14 IC15.13 | 45.82,56.08 45.82,52.02 48.26,49.58 IC6.20 | 45.82,56.08 45.82,60.05 43.72,62.15 42.5,62.15 39.42,65.24 39.42,66.04 IC2.16 | IC11.10 31.8,66.04 31.8,63.8 38.2,57.4 38.2,55.07 45.01,48.26 C11.1 44.91,48.16 44.91,44.6 43.99,43.69 43.99,42.47 47.95,38.51 47.95,28.04 IC13.10 48.26,26.32 47.18,25.24 42,25.24 | IC14.14 15.4,80.01 14.73,79.34 v14.73,68.24 | RN1.1 11.53,44.35 11.53,50.07 C4.1 8.89,52.7 JP1.2 | 42,25.24 35.72,25.24 IC13.16 | R5.2 v49.93,25.4 | JP3.2 25.4,10.36 34.28,19.25 34.28,21.38 36.61,23.7 41.7,23.7 42,24.01 42,25.24 | 45.82,56.08 62,56.08 63.91,57.99 63.91,64.2 65.75,66.04 V2.16 67.31,69.06 66.2,70.17 61.83,70.17 60.88,71.12 60.88,73.74 62.23,75.09 IC12.14

### Text on the board
tPlace: 74HC11 | 74HC30 | 74HC74 | intern | extern | 74HC32 | 74HC04 | 74HC00 | Sound | 74HC163 | 74HC165 | 74HC138 | SN76489 | 74HC574 | 74HC574 | Minimal 64x4 / Expansion 1 Rev.4b / SN76489 Sound / Kempston Joystick Port / SD Card SPI | 74HC595 | /CS | SCK | MOSI | MISO | VCC | GND